# Altium schematic sheet 16_I2C_EEPROM_RTC.SchDoc
size A4
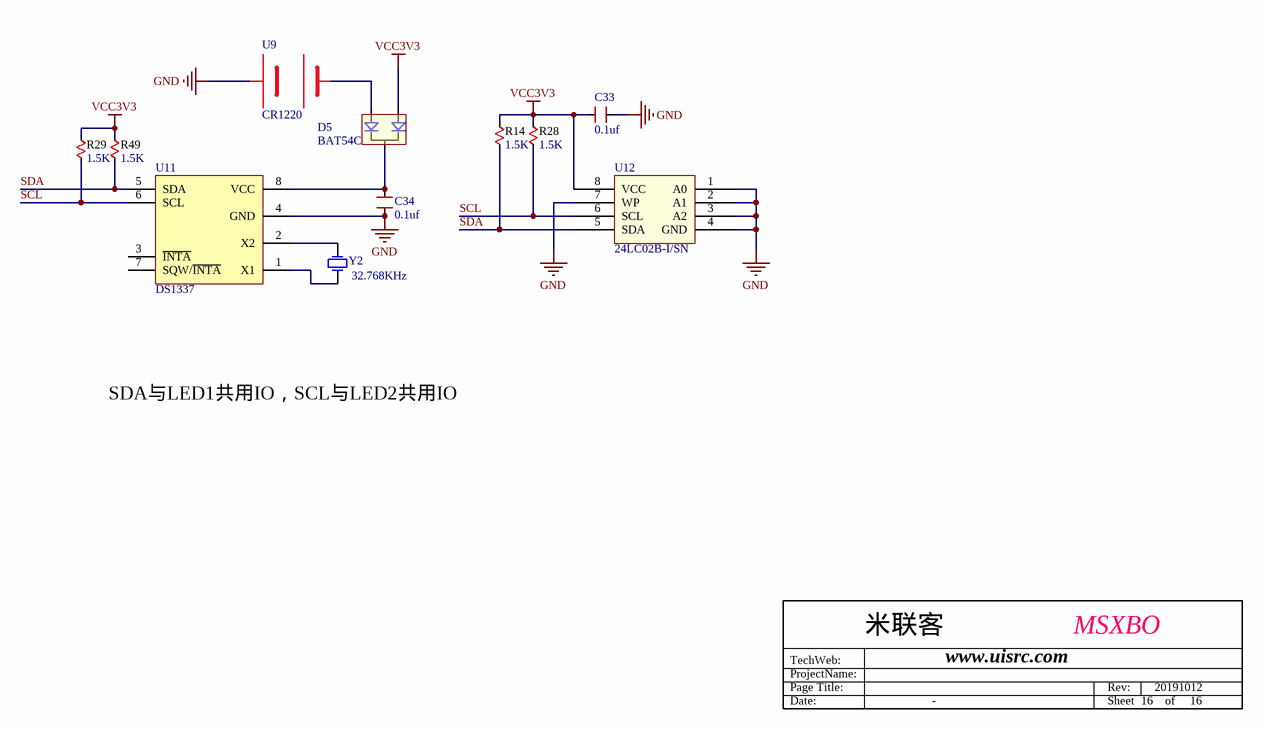
[diagram p0: 16_I2C_EEPROM_RTC.SchDoc]

## Parts
C33  0.1uf  [CAP0402]
C34  0.1uf  [CAP0402]
D5  BAT54C  [SOT-23]
R14  1.5K  [RES0402]
R28  1.5K  [RES0402]
R29  1.5K  [RES0402]
R49  1.5K  [RES0402]
U9  CR1220  [R190]
U11  DS1337  [SOP8]
U12  24LC02B-I/SN  [SOP8]
Y2  32.768KHz  [XTAL32]

## Nets
GND: C33.1 C34.2 U9.2 U11.4(GND) U12.1(A0) U12.2(A1) U12.3(A2) U12.4(GND) U12.7(WP)
VCC3V3: C33.2 D5.1 R14.2 R28.2 R29.2 R49.2 U12.8(VCC)
SCL: R28.1 R29.1 U11.6(SCL) U12.6(SCL)
SDA: R14.1 R49.1 U11.5(SDA) U12.5(SDA)
NetC34_1: C34.1 D5.3 U11.8(VCC)
NetD5_2: D5.2 U9.1
NetU11_1: U11.1(X1) Y2.2(OSC2)
NetU11_2: U11.2(X2) Y2.1(OSC1)

Not connected (* = marked no-connect by the designer): U11 3(~{INTA}) 7(SQW/~{INTA})

## Notes on the sheet
- SDA与LED1共用IO，SCL与LED2共用IO
- ProjectName:
- TechWeb:
- Page Title:
- 米联客
- www.uisrc.com
- MSXBO
- Rev:
- 20191012
- Date:
- -
- Sheet
- 16    of     16

## Library data of the parts
C33 C34 = CAPACITOR: Generic Capacitor; DPN: *; Manufacturer: *
D5 = BAT54C: 双肖特基二极管
R14 R28 R29 R49 = RESISTOR: Generic Resistor; Value: 100; Manufacturer: *; DPN: *
Y2 = XTAL: 普通晶振; Published: 8-Jun-2000; LatestRevisionDate: 17-Jul-2002; LatestRevisionNote: Re-released for DXP Platform.; Publisher: Altium Limited; Value: 32.768KHz